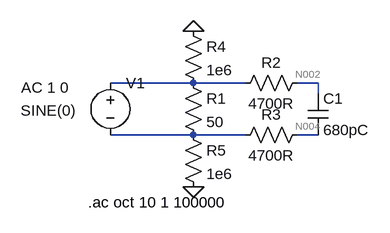
[diagram p0: schematic ADC_frontend.asc]
ADC_frontend.asc, the LTspice schematic file:
Version 4
SHEET 1 880 680
WIRE 0 48 -128 48
WIRE 80 48 0 48
WIRE 192 48 160 48
WIRE 192 64 192 48
WIRE 0 128 -128 128
WIRE 80 128 0 128
WIRE 192 128 160 128
FLAG 0 208 0
FLAG 0 -32 0
SYMBOL res -16 32 R0
SYMATTR InstName R1
SYMATTR Value 50
SYMBOL res 176 32 R90
WINDOW 0 0 56 VBottom 2
WINDOW 3 32 56 VTop 2
SYMATTR InstName R2
SYMATTR Value 4700R
SYMBOL res 176 112 R90
WINDOW 0 0 56 VBottom 2
WINDOW 3 32 56 VTop 2
SYMATTR InstName R3
SYMATTR Value 4700R
SYMBOL cap 176 64 R0
SYMATTR InstName C1
SYMATTR Value 680pC
SYMBOL voltage -128 32 R0
WINDOW 3 -138 58 Left 2
WINDOW 123 -137 23 Left 2
WINDOW 39 0 0 Left 2
SYMATTR InstName V1
SYMATTR Value SINE(0)
SYMATTR Value2 AC 1 0
SYMBOL res -16 -48 R0
SYMATTR InstName R4
SYMATTR Value 1e6
SYMBOL res -16 112 R0
SYMATTR InstName R5
SYMATTR Value 1e6
TEXT -162 232 Left 2 !.ac oct 10 1 100000

The netlist it stands for:
* ADC_frontend.asc
R1 N001 N003 50
R2 N002 N001 4700R
R3 N004 N003 4700R
C1 N002 N004 680pC
V1 N001 N003 SINE(0) AC 1 0
R4 0 N001 1e6
R5 N003 0 1e6
.ac oct 10 1 100000
.backanno
.end

* Results of the author's LTspice run, read from the files saved beside the schematic
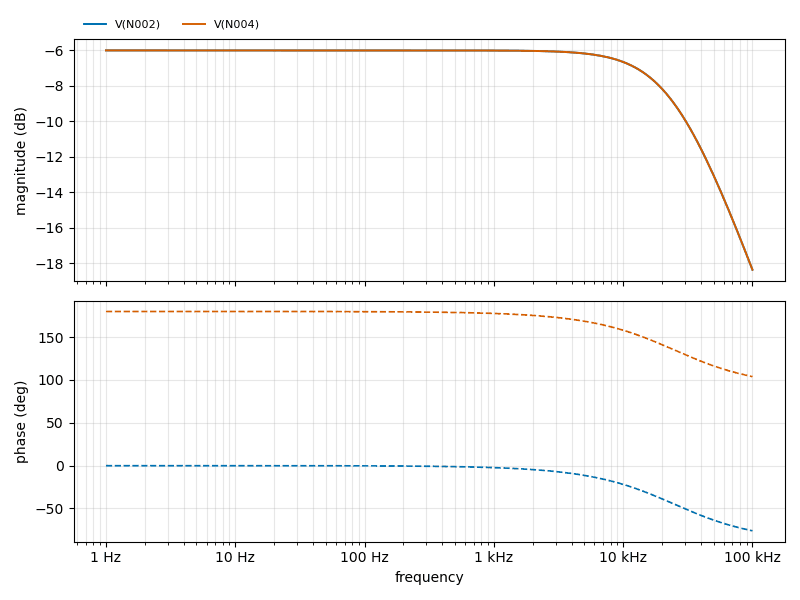
[diagram p1: AC Analysis of ADC_frontend.asc, plotted from the saved traces]
* AC Analysis, 1 run:
*   V(N002): -6.02 dB at 1 Hz, -18.36 dB at 100 kHz, peak -6.02 dB at 1 Hz, 3 dB below the peak at 24.9 kHz
*   V(N004): -6.02 dB at 1 Hz, -18.36 dB at 100 kHz, peak -6.02 dB at 1 Hz, 3 dB below the peak at 24.9 kHz